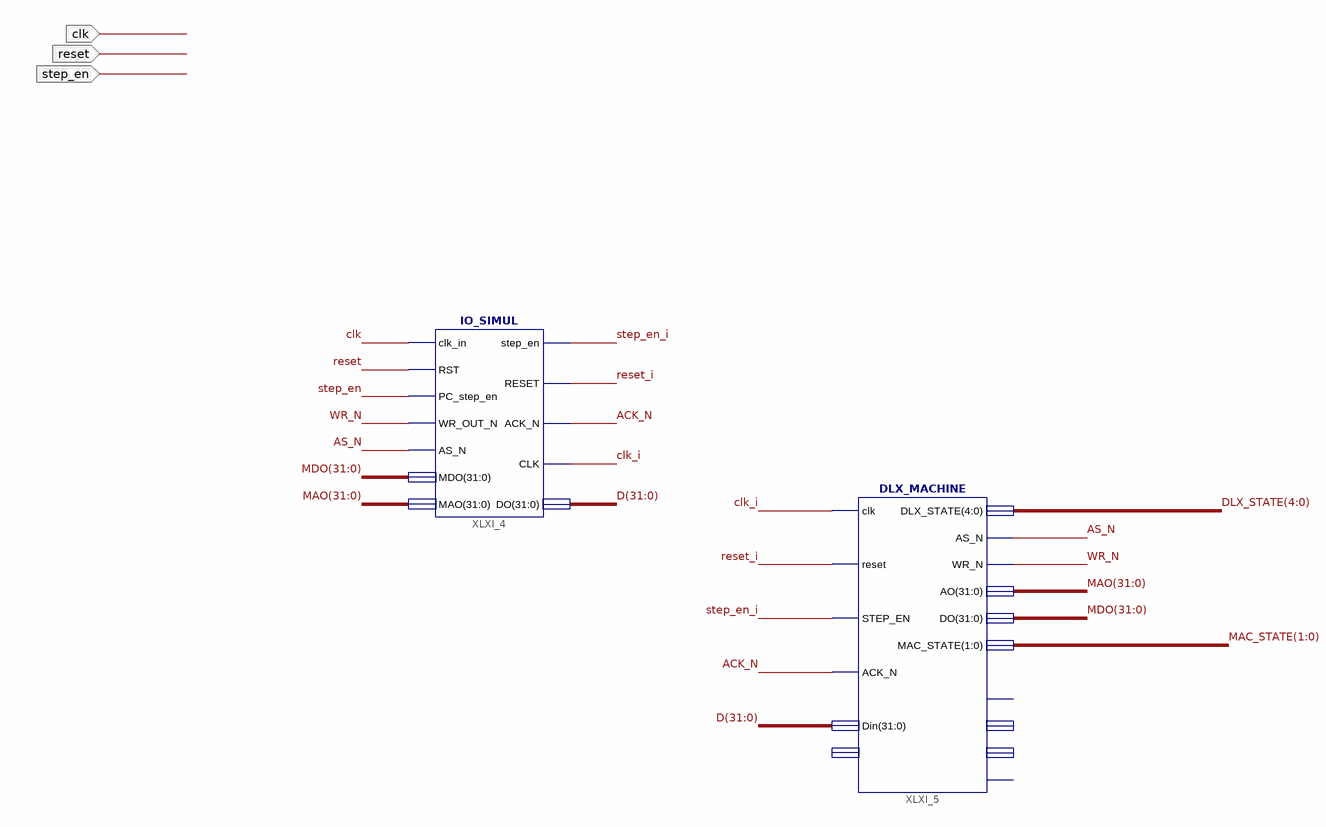
[diagram p0: schematic sheet 1]
// Xilinx ISE schematic TOP_LEVEL_IOSIMUL.sch (spartan6) as structural Verilog: 2 symbols, 3 ports
module TOP_LEVEL_IOSIMUL (
  input  clk,
  input  reset,
  input  step_en
);

  wire ACK_N, AS_N, clk_i, reset_i, step_en_i, WR_N;
  wire [1:0] MAC_STATE;
  wire [4:0] DLX_STATE;
  wire [31:0] D, MAO, MDO;

  IO_SIMUL XLXI_4 (
    .clk_in(clk), .RST(reset), .PC_step_en(step_en), .WR_OUT_N(WR_N), .AS_N(AS_N), .MDO(MDO), .MAO(MAO),
    .step_en(step_en_i), .RESET(reset_i), .ACK_N(ACK_N), .CLK(clk_i), .DO(D));
  DLX_MACHINE XLXI_5 (
    .clk(clk_i), .reset(reset_i), .STEP_EN(step_en_i), .ACK_N(ACK_N), .Din(D), .DLX_STATE(DLX_STATE),
    .AS_N(AS_N), .WR_N(WR_N), .AO(MAO), .DO(MDO), .MAC_STATE(MAC_STATE));  // open: Daddr, STOP_N, PC, D, IN_INIT
endmodule
